# Altium schematic sheet DClassAmp.SchDoc: D Class Amplifier
size 431 x 279 mm; CheckedBy: K.Heyer; DrawnBy: K.Heyer; Organization: ORGANIZATION; Address1: 207; Address2: 13399 104 Ave; Address3: Surrey BC, V3T 0C9; Address4: Canada; Revision: V0.0.0; SheetNumber: 1; SheetTotal: 5; Project: D Class Amp; ENG_APP_DATE: --/--/--; DSN_APP_DATE: --/--/--; CHK_APP_DATE: --/--/--
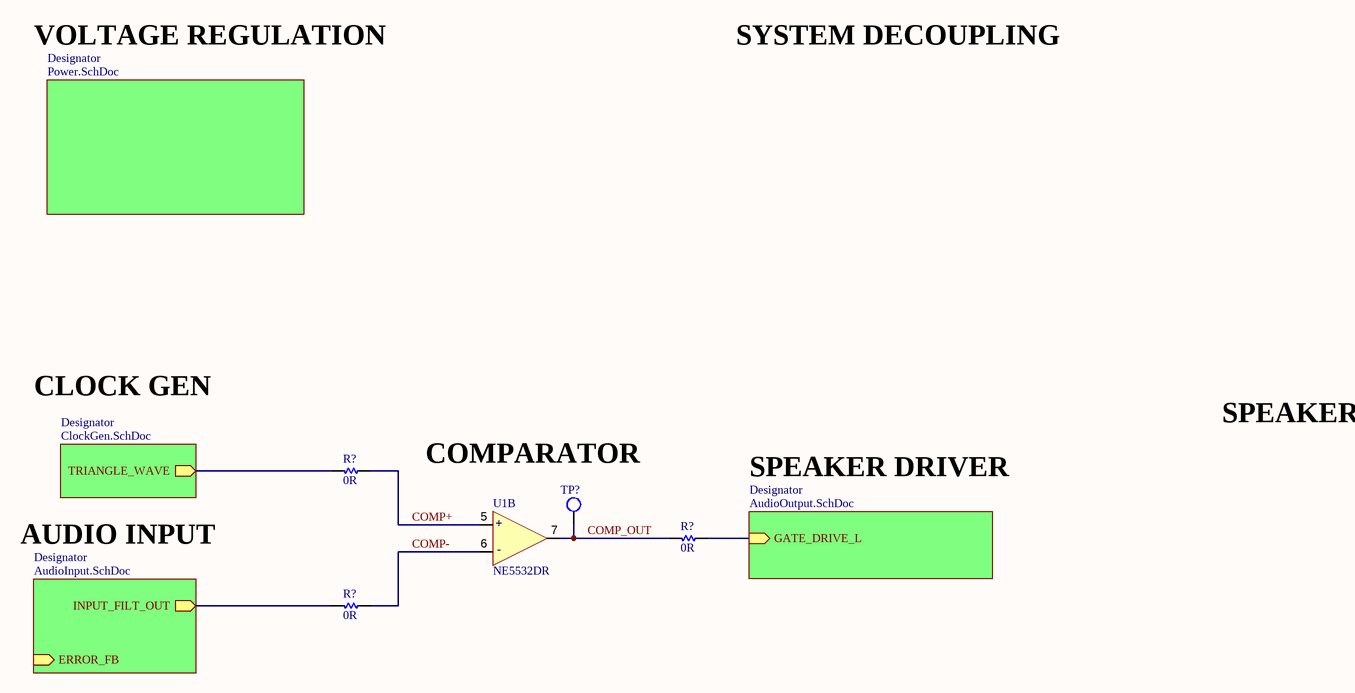
[diagram p0: DClassAmp.SchDoc]

## Parts
(Parts that share a designator on the sheet are numbered #1, #2 ... from top to bottom, then left to right.)
R?#1  0R  [R0402]
R?#2  0R  [R0402]
R?#3  0R  [R0402]
TP?  1mm  [TESTPOINT_SMT]  (value not drawn)
U1  NE5532DR  [SO8 6.2x5mm TI D0008A]  (part B of 2)

## Sub-sheets
Designator = AudioInput.SchDoc: INPUT_FILT_OUT (out), ERROR_FB (in)
Designator = ClockGen.SchDoc: TRIANGLE_WAVE (out)
Designator = AudioOutput.SchDoc: GATE_DRIVE_L (in)
Designator = Power.SchDoc: no entries

## Nets
COMP+: R?#1.1 U1.5(+)
COMP-: R?#3.1 U1.6(-)
COMP_OUT: R?#2.2 TP?.1 U1.7
NetR?#1_2: R?#1.2 ; sheet Designator/TRIANGLE_WAVE
NetR?#2_1: R?#2.1 ; sheet Designator/GATE_DRIVE_L
NetR?#3_2: R?#3.2 ; sheet Designator/INPUT_FILT_OUT

## Notes on the sheet
- VOLTAGE REGULATION
- SYSTEM DECOUPLING
- CLOCK GEN
- COMPARATOR
- SPEAKER DRIVER
- SPEAKER
- AUDIO INPUT
- REV:
- PROJECT:
- DATE:
- TITLE
- SHEET
- OF
- DESIGNED:
- REVIEWED:

## Library data of the parts
R?#1-R?#3 = RES 0R 63mW 0402: GLOVE, POLYAMIDE, L/FREE, PU, SIZE 6 - More Details; Manufacturer: Stackpole Electronics; Manufacturer Part Number: RMCF0402ZT0R00; Power Rating: 63mW; Current Rating: 1A; Working Voltage: 50V; Supplier 1: Digi-Key; RoHS: Yes; Category: Chip SMD Resistors; Stock 1: 5203223; Pricing 1: 1=0.10000, 10=0.01000, 25=0.00720, 50=0.00560, 100=0.00410, 250=0.00316, 500=0.00252, 1000=0.00186, 5000=0.00133 (USD); Mount: Surface Mount; Case/Package: 0402; Case Code (Metric): 1005; Case Code (Imperial): 0402; Contact Plating: Tin,Matte; Min Operating Temperature: -55°C; Max Operating Temperature: 155°C; Resistance: 0R; Packaging: Tape and Reel; Resistor Type: Thick Film; Number of Terminations: 2; Max Power Dissipation: 63mW; Features: Automotive AEC-Q200; Series: RMCF; Technology: THICK FILM; Construction: Rectangular; Length: 0.039inch; Width: 0.02inch; Height: 0.016inch; Depth: 0.5mm; Radiation Hardening: No; Military Standard: Not; Lead Free: Lead Free; RoHS Compliant: Yes; ComponentLink1URL: https://datasheet.ciiva.com/26835/getdatasheetpartid-409751-26835612.pdf?src-supplier=Verical; ComponentLink1Description: https://datasheet.ciiva.com/26835/getdatasheetpartid-409751-26835612.pdf?src-supplier=Verical; Supplier Part Number 1: RMCF0402ZT0R00CT-ND
TP? = TP 1mm: SMT testpoint
U1 = IC OPAMP AUDIO NE5532DR: 2-channel, 10-MHz, 26-V output swing, low-noise audio op amp 8-SOIC 0 to 70; Manufacturer: Texas Instruments; Voltage Gain: 100dB; Min Dual Supply Voltage: 5V; Max Dual Supply Voltage: 15V; Output Current: 38mA; Nominal Supply Current: 16mA; Common Mode Rejection Ratio: 70dB; Number of Channels: 2; Slew Rate: 9V/µs; Gain Bandwidth Product: 10MHz; Input Bias Current: 800nA; Input Offset Voltage (Vos): 4mV; Operating Supply Current: 8mA; Dual Supply Voltage: 9V; Supplier 1: Digi-Key; Manufacturer Part Number: NE5532DR; RoHS: Yes; Category: Amplifiers - Op Amps, Buffer, Instrumentation; Stock 1: 29111; Pricing 1: 1=0.60000, 10=0.51300, 25=0.47840, 100=0.38290, 250=0.35552, 500=0.30082, 1000=0.23246 (USD); Case/Package: D; Number of Pins: 8; Contact Plating: Gold; Min Operating Temperature: 0°C; Max Operating Temperature: 70°C; Packaging: Tape and Reel; Package Quantity: 1; Number of Circuits: 2; Output Current per Channel: 38mA; Nominal Gain Bandwidth Product: 10MHz; Unity Gain Bandwidth Product: 10MHz; Number of Elements: 2; Bandwidth: 10MHz; Max I/O Voltage: 4mV; Max Supply Voltage: 15V; Number of Amplifiers: 2; Length: 4.9mm; Width: 3.91mm; Height: 1.58mm; Radiation Hardening: No; Lead Free: Lead Free; RoHS Compliant: Yes; REACH SVHC: No SVHC; ComponentLink1URL: https://datasheet.ciiva.com/1796/ne5532-1796190.pdf?src-supplier=Digi-Key; ComponentLink1Description: https://datasheet.ciiva.com/1796/ne5532-1796190.pdf?src-supplier=Digi-Key; ComponentLink2URL: https://datasheet.ciiva.com/1796/ne5532-1796189.pdf?src-supplier=Digi-Key; ComponentLink2Description: https://datasheet.ciiva.com/1796/ne5532-1796189.pdf?src-supplier=Digi-Key; ComponentLink3URL: https://datasheet.ciiva.com/1796/ne5532-1796191.pdf?src-supplier=Digi-Key; ComponentLink3Description: https://datasheet.ciiva.com/1796/ne5532-1796191.pdf?src-supplier=Digi-Key; Supplier Part Number 1: 296-13622-1-ND